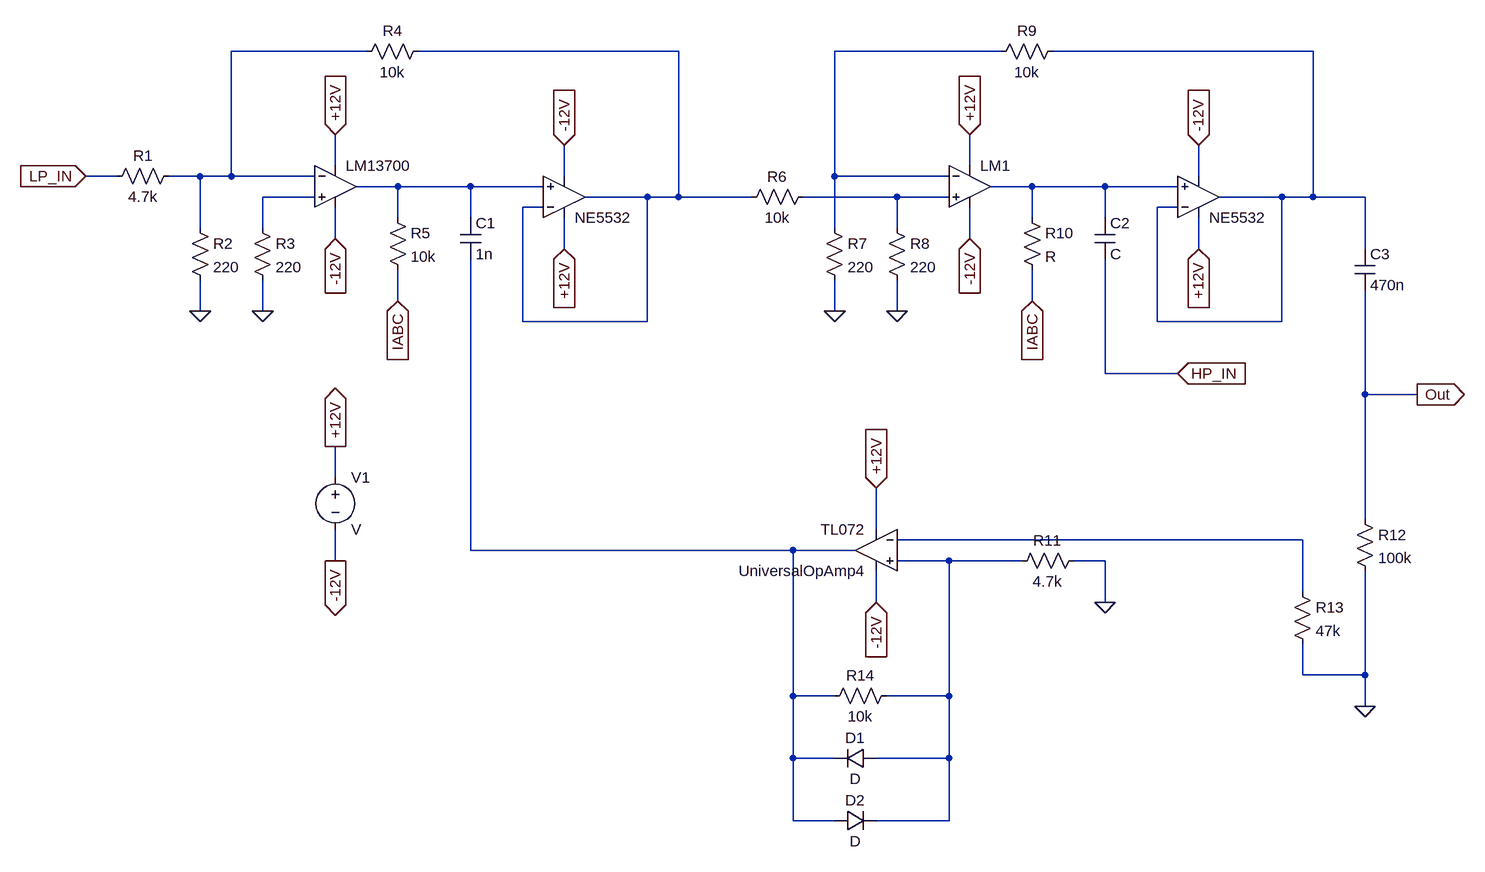
[diagram p0: schematic VCF.asc]
VCF.asc, the LTspice schematic file:
Version 4.1
SHEET 1 2100 944
WIRE 384 -288 176 -288
WIRE 864 -288 464 -288
WIRE 1360 -288 1104 -288
WIRE 1840 -288 1440 -288
WIRE 336 -112 336 -160
WIRE 1312 -112 1312 -160
WIRE 0 -96 -48 -96
WIRE 128 -96 80 -96
WIRE 176 -96 176 -288
WIRE 176 -96 128 -96
WIRE 304 -96 176 -96
WIRE 688 -96 688 -144
WIRE 1104 -96 1104 -288
WIRE 1280 -96 1104 -96
WIRE 1664 -96 1664 -144
WIRE 432 -80 368 -80
WIRE 544 -80 432 -80
WIRE 656 -80 544 -80
WIRE 1408 -80 1344 -80
WIRE 1520 -80 1408 -80
WIRE 1632 -80 1520 -80
WIRE 304 -64 224 -64
WIRE 816 -64 720 -64
WIRE 864 -64 864 -288
WIRE 864 -64 816 -64
WIRE 976 -64 864 -64
WIRE 1200 -64 1056 -64
WIRE 1280 -64 1200 -64
WIRE 1792 -64 1696 -64
WIRE 1840 -64 1840 -288
WIRE 1840 -64 1792 -64
WIRE 1920 -64 1840 -64
WIRE 656 -48 624 -48
WIRE 1632 -48 1600 -48
WIRE 432 -32 432 -80
WIRE 544 -32 544 -80
WIRE 1408 -32 1408 -80
WIRE 1520 -32 1520 -80
WIRE 128 -16 128 -96
WIRE 224 -16 224 -64
WIRE 1104 -16 1104 -96
WIRE 1200 -16 1200 -64
WIRE 336 0 336 -48
WIRE 1312 0 1312 -48
WIRE 688 16 688 -32
WIRE 1664 16 1664 -32
WIRE 1920 16 1920 -64
WIRE 432 96 432 48
WIRE 1408 96 1408 48
WIRE 128 112 128 64
WIRE 224 112 224 64
WIRE 1104 112 1104 64
WIRE 1200 112 1200 64
WIRE 624 128 624 -48
WIRE 816 128 816 -64
WIRE 816 128 624 128
WIRE 1600 128 1600 -48
WIRE 1792 128 1792 -64
WIRE 1792 128 1600 128
WIRE 1520 208 1520 32
WIRE 1632 208 1520 208
WIRE 1920 240 1920 80
WIRE 2000 240 1920 240
WIRE 336 368 336 320
WIRE 1920 432 1920 240
WIRE 1168 448 1168 384
WIRE 1824 464 1200 464
WIRE 544 480 544 32
WIRE 1040 480 544 480
WIRE 1136 480 1040 480
WIRE 336 496 336 448
WIRE 1280 496 1200 496
WIRE 1392 496 1280 496
WIRE 1520 496 1472 496
WIRE 1824 544 1824 464
WIRE 1168 560 1168 512
WIRE 1520 560 1520 496
WIRE 1824 672 1824 624
WIRE 1920 672 1920 512
WIRE 1920 672 1824 672
WIRE 1040 704 1040 480
WIRE 1104 704 1040 704
WIRE 1280 704 1280 496
WIRE 1280 704 1184 704
WIRE 1920 720 1920 672
WIRE 1040 800 1040 704
WIRE 1104 800 1040 800
WIRE 1280 800 1280 704
WIRE 1280 800 1168 800
WIRE 1040 896 1040 800
WIRE 1104 896 1040 896
WIRE 1280 896 1280 800
WIRE 1280 896 1168 896
FLAG 336 496 -12V
IOPIN 336 496 Out
FLAG 336 320 +12V
IOPIN 336 320 Out
FLAG 336 -160 +12V
IOPIN 336 -160 In
FLAG 336 0 -12V
IOPIN 336 0 In
FLAG 224 112 0
FLAG 128 112 0
FLAG -48 -96 LP_IN
IOPIN -48 -96 In
FLAG 432 96 IABC
IOPIN 432 96 In
FLAG 688 16 +12V
IOPIN 688 16 In
FLAG 688 -144 -12V
IOPIN 688 -144 In
FLAG 1312 -160 +12V
IOPIN 1312 -160 In
FLAG 1312 0 -12V
IOPIN 1312 0 In
FLAG 1200 112 0
FLAG 1104 112 0
FLAG 1408 96 IABC
IOPIN 1408 96 In
FLAG 1664 16 +12V
IOPIN 1664 16 In
FLAG 1664 -144 -12V
IOPIN 1664 -144 In
FLAG 1632 208 HP_IN
IOPIN 1632 208 In
FLAG 1520 560 0
FLAG 1168 560 -12V
IOPIN 1168 560 In
FLAG 1168 384 +12V
IOPIN 1168 384 In
FLAG 1920 720 0
FLAG 2000 240 Out
IOPIN 2000 240 Out
SYMBOL res 96 -112 R90
WINDOW 0 0 56 VBottom 2
WINDOW 3 32 56 VTop 2
SYMATTR InstName R1
SYMATTR Value 4.7k
SYMBOL res 112 -32 R0
SYMATTR InstName R2
SYMATTR Value 220
SYMBOL res 208 -32 R0
SYMATTR InstName R3
SYMATTR Value 220
SYMBOL OpAmps\\UniversalOpAmp2 336 -80 R0
SYMATTR InstName LM13700
SYMBOL voltage 336 352 R0
SYMATTR InstName V1
SYMBOL res 480 -304 R90
WINDOW 0 0 56 VBottom 2
WINDOW 3 32 56 VTop 2
SYMATTR InstName R4
SYMATTR Value 10k
SYMBOL cap 528 -32 R0
SYMATTR InstName C1
SYMATTR Value 1n
SYMBOL res 416 -48 R0
SYMATTR InstName R5
SYMATTR Value 10k
SYMBOL OpAmps\\UniversalOpAmp2 688 -64 M180
SYMATTR InstName NE5532
SYMBOL res 1072 -80 R90
WINDOW 0 0 56 VBottom 2
WINDOW 3 32 56 VTop 2
SYMATTR InstName R6
SYMATTR Value 10k
SYMBOL res 1088 -32 R0
SYMATTR InstName R7
SYMATTR Value 220
SYMBOL res 1184 -32 R0
SYMATTR InstName R8
SYMATTR Value 220
SYMBOL OpAmps\\UniversalOpAmp2 1312 -80 R0
SYMATTR InstName LM1
SYMBOL res 1456 -304 R90
WINDOW 0 0 56 VBottom 2
WINDOW 3 32 56 VTop 2
SYMATTR InstName R9
SYMATTR Value 10k
SYMBOL cap 1504 -32 R0
SYMATTR InstName C2
SYMBOL res 1392 -48 R0
SYMATTR InstName R10
SYMBOL OpAmps\\UniversalOpAmp2 1664 -64 M180
SYMATTR InstName NE5532
SYMBOL cap 1904 16 R0
SYMATTR InstName C3
SYMATTR Value 470n
SYMBOL OpAmps\\UniversalOpAmp4 1168 480 M0
SYMATTR InstName TL072
SYMBOL res 1488 480 R90
WINDOW 0 0 56 VBottom 2
WINDOW 3 32 56 VTop 2
SYMATTR InstName R11
SYMATTR Value 4.7k
SYMBOL res 1904 416 R0
SYMATTR InstName R12
SYMATTR Value 100k
SYMBOL res 1808 528 R0
SYMATTR InstName R13
SYMATTR Value 47k
SYMBOL res 1200 688 R90
WINDOW 0 0 56 VBottom 2
WINDOW 3 32 56 VTop 2
SYMATTR InstName R14
SYMATTR Value 10k
SYMBOL diode 1168 784 R90
WINDOW 0 0 32 VBottom 2
WINDOW 3 32 32 VTop 2
SYMATTR InstName D1
SYMBOL diode 1104 912 R270
WINDOW 0 32 32 VTop 2
WINDOW 3 0 32 VBottom 2
SYMATTR InstName D2

The netlist it stands for:
* VCF.asc
R1 N001 LP_IN 4.7k
R2 N001 0 220
R3 N007 0 220
X§LM13700 N007 N001 +12V -12V N005 level2 Avol=1Meg GBW=10Meg Slew=10Meg Ilimit=25m Rail=0 Vos=0 En=0 Enk=0 In=0 Ink=0 Rin=500Meg  ; pins In+ In- V+ V- OUT
V1 +12V -12V V
R4 N002 N001 10k
C1 N005 N010 1n
R5 N005 IABC 10k
X§NE5532 N005 N002 +12V -12V N002 level2 Avol=1Meg GBW=10Meg Slew=10Meg Ilimit=25m Rail=0 Vos=0 En=0 Enk=0 In=0 Ink=0 Rin=500Meg  ; pins In+ In- V+ V- OUT
R6 N008 N002 10k
R7 N003 0 220
R8 N008 0 220
X§LM1 N008 N003 +12V -12V N006 level2 Avol=1Meg GBW=10Meg Slew=10Meg Ilimit=25m Rail=0 Vos=0 En=0 Enk=0 In=0 Ink=0 Rin=500Meg  ; pins In+ In- V+ V- OUT
R9 N004 N003 10k
C2 N006 HP_IN C
R10 N006 IABC R
X§NE5532 N006 N004 +12V -12V N004 level2 Avol=1Meg GBW=10Meg Slew=10Meg Ilimit=25m Rail=0 Vos=0 En=0 Enk=0 In=0 Ink=0 Rin=500Meg  ; pins In+ In- V+ V- OUT
C3 N004 Out 470n
* TL072: UniversalOpAmp4 (symbol OpAmps\UniversalOpAmp4 not available, pins judged from their places): In+=N011 In-=N009 V+=+12V V-=-12V OUT=N010
R11 0 N011 4.7k
R12 Out 0 100k
R13 N009 0 47k
R14 N011 N010 10k
D1 N011 N010 D
D2 N010 N011 D
.model D D
.lib standard.dio
.lib UniversalOpAmp2.lib
.backanno
.end